# Altium schematic sheet IMx6Q_EX.SchDoc
size A3
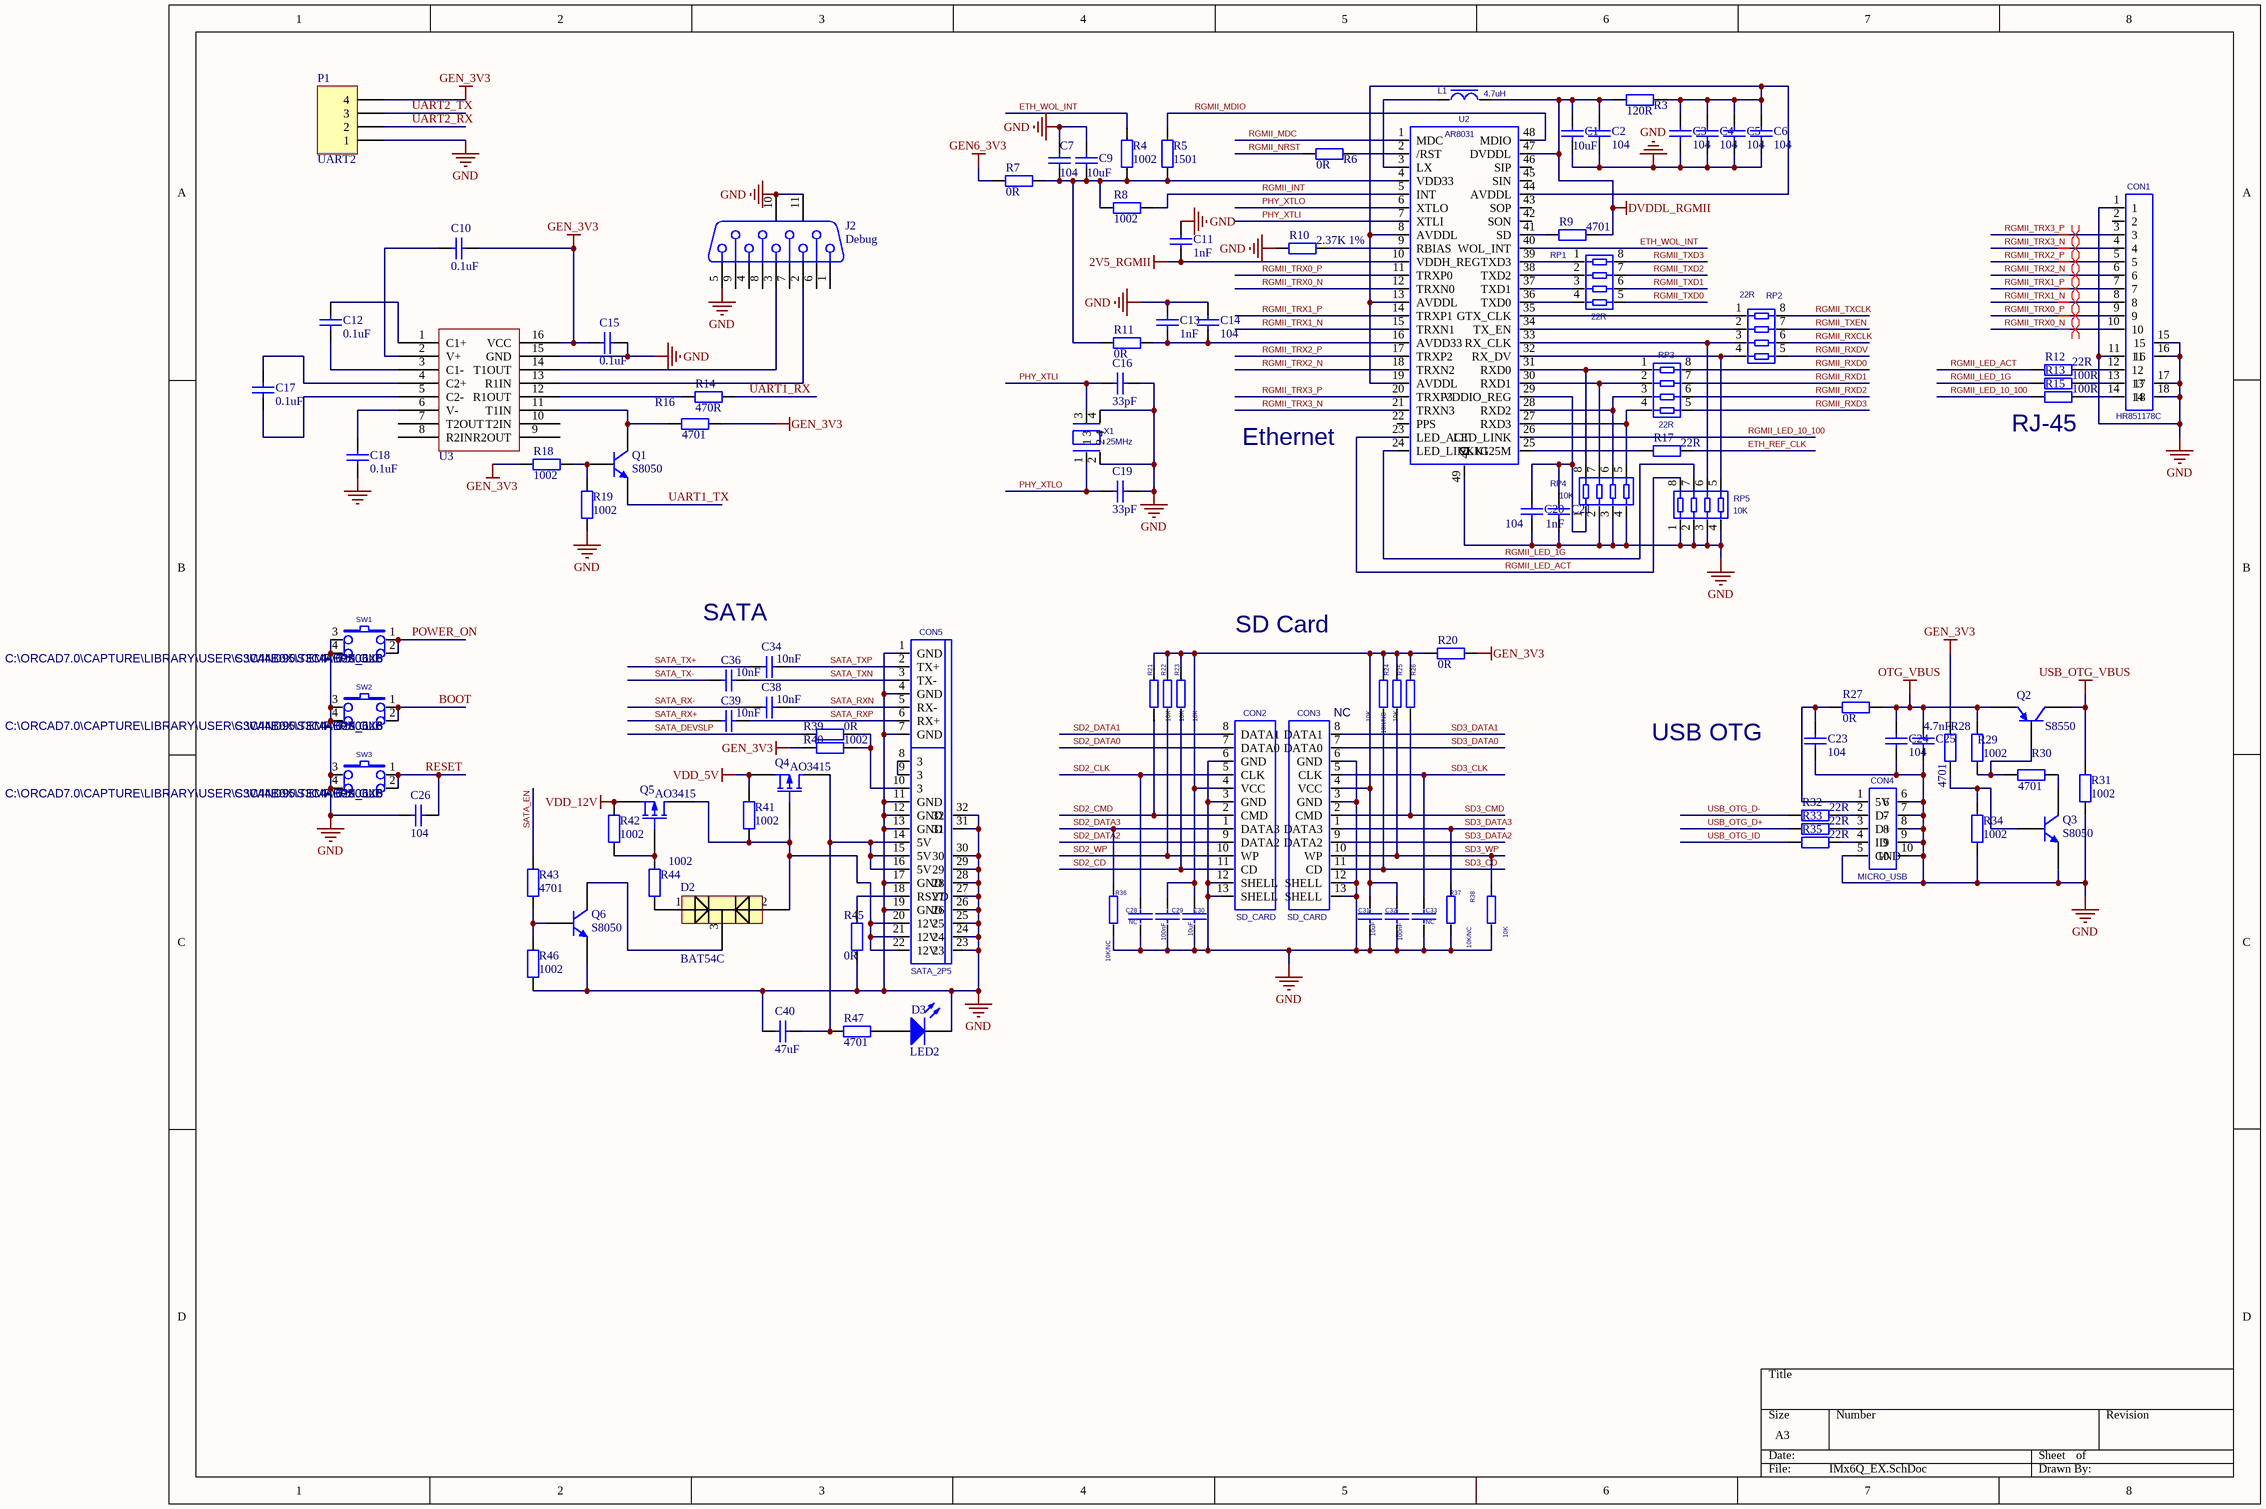
[diagram p0: IMx6Q_EX.SchDoc]

## Parts
C1  10uF  [0805C]
C2  104  [0805C]
C3  104  [0805C]
C4  104  [0805C]
C5  104  [0805C]
C6  104  [0805C]
C7  104  [0805C]
C9  10uF  [0805C]
C10  0.1uF  [0805C]
C11  1nF  [0805C]
C12  0.1uF  [0805C]
C13  1nF  [0805C]
C14  104  [0805C]
C15  0.1uF  [0805C]
C16  33pF  [0805C]
C17  0.1uF  [0805C]
C18  0.1uF  [0805C]
C19  33pF  [0805C]
C20  104  [0805C]
C21  1nF  [0805C]
C23  104  [0805C]
C24  104  [0805C]
C25  4.7nF  [0805C]
C26  104  [0805C]
C28  value NC  [0805C]  (hidden comment: C_0603)
C29  value 100nF  [0805C]  (hidden comment: C_0603)
C30  value 10uF  [0805C]  (hidden comment: C_0603)
C31  value 10uF  [0805C]  (hidden comment: C_0603)
C32  value 100nF  [0805C]  (hidden comment: C_0603)
C33  value NC  [0805C]  (hidden comment: C_0603)
C34  10nF  [0805C]
C36  10nF  [0805C]
C38  10nF  [0805C]
C39  10nF  [0805C]
C40  47uF  [0805C]
CON1  HR851178C  [HR851178C]
CON2  SD_CARD  [SD_CARD]
CON3  SD_CARD  [SD_CARD]
CON4  MICRO_USB  [MICRO_USB]
CON5  SATA_2P5  [SATA_MICRO_2P5]
D2  BAT54C  [SOT-23-3]
D3  LED2  [0805_LED]
J2  Debug  [DSUB1.385-2H9]
L1  value 4.7uH  [L_3-3]  (hidden comment: L_3-3)
P1  UART2  [HDR1X4]
Q1  S8050  [SOT23]
Q2  S8550  [SOT23-S8550]
Q3  S8050  [SOT23]
Q4  AO3415  [SOT23-AO3415]
Q5  AO3415  [SOT23-AO3415]
Q6  S8050  [SOT23-AO3415]
R3  120R  [0805R]
R4  1002  [0805R]
R5  1501  [0805R]
R6  0R  [0805R]
R7  0R  [0805R]
R8  1002  [0805R]
R9  4701  [0805R]
R10  2.37K 1%  [0805R]
R11  0R  [0805R]
R12  22R  [0805R]
R13  100R  [0805R]
R14  470R  [0805R]
R15  100R  [0805R]
R16  4701  [0805R]
R17  22R  [0805R]
R18  1002  [0805R]
R19  1002  [0805R]
R20  0R  [0805R]
R21  value 10K  [0805R]  (hidden comment: R_0603)
R22  value 10K  [0805R]  (hidden comment: R_0603)
R23  value 10K  [0805R]  (hidden comment: R_0603)
R24  value 10K  [0805R]  (hidden comment: R_0603)
R25  value 10K/NC  [0805R]  (hidden comment: R_0603)
R26  value 10K  [0805R]  (hidden comment: R_0603)
R27  0R  [0805R]
R28  4701  [0805R]
R29  1002  [0805R]
R30  4701  [0805R]
R31  1002  [0805R]
R32  22R  [0805R]
R33  22R  [0805R]
R34  1002  [0805R]
R35  22R  [0805R]
R36  value 10K/NC  [0805R]  (hidden comment: R_0603)
R37  value 10K/NC  [0805R]  (hidden comment: R_0603)
R38  value 10K  [0805R]  (hidden comment: R_0603)
R39  0R  [0805R]
R40  1002  [0805R]
R41  1002  [0805R]
R42  1002  [0805R]
R43  4701  [0805R]
R44  1002  [0805R]
R45  0R  [0805R]
R46  1002  [0805R]
R47  4701  [0805R]
RP1  value 22R  [RP4_0603]  (hidden comment: RP4_0603)
RP2  value 22R  [RP4_0603]  (hidden comment: RP4_0603)
RP3  value 22R  [RP4_0603]  (hidden comment: RP4_0603)
RP4  value 10K  [RP4_0603]  (hidden comment: RP4_0603)
RP5  value 10K  [RP4_0603]  (hidden comment: RP4_0603)
SW1  ALPS_6X6  Source Path: C:\ORCAD7.0\CAPTURE\LIBRARY\USER\S3C44B0X\S3C44B0X.OLB  SDTSourceLibName: C:\WIND95\TEMP\6200.LIB  [ALPS_6*6]
SW2  ALPS_6X6  Source Path: C:\ORCAD7.0\CAPTURE\LIBRARY\USER\S3C44B0X\S3C44B0X.OLB  SDTSourceLibName: C:\WIND95\TEMP\6200.LIB  [ALPS_6*6]
SW3  ALPS_6X6  Source Path: C:\ORCAD7.0\CAPTURE\LIBRARY\USER\S3C44B0X\S3C44B0X.OLB  SDTSourceLibName: C:\WIND95\TEMP\6200.LIB  [ALPS_6*6]
U2  AR8031  [QFN-48]
U3  MAX232  [SOP16]  (value not drawn)
X1  value 25MHz  [OSC_3225_4P]  (hidden comment: OSC_3225_4P)

## Nets
2V5_RGMII: C11.2 U2.10(VDDH_REG)
DVDDL_RGMII: C1.1 C2.1 L1.2 R3.1 R9.1 U2.47(DVDDL)
GEN6_3V3: R7.1
GEN_3V3: C10.1 C15.2 P1.4 R16.1 R18.2 R20.2 R28.2 R40.2 U3.16(VCC)
GND: C1.2 C2.2 C3.2 C4.2 C5.2 C6.2 C7.2 C9.2 C11.1 C13.1 C14.1 C15.1 C16.2 C18.1 C19.2 C20.2 C21.2 C23.2 C24.2 C25.2 C26.1 C28.1 C29.1 C30.1 C31.1 C32.1 C33.1 C40.2 CON1.1 CON1.11 CON1.15 CON1.16 CON1.17 CON1.18 CON2.3(GND) CON2.6(GND) CON2.12(SHELL) CON2.13(SHELL) CON3.3(GND) CON3.6(GND) CON3.12(SHELL) CON3.13(SHELL) CON4.5(GND) CON4.6 CON4.7 CON4.8 CON4.9 CON4.10 CON5.1(GND) CON5.4(GND) CON5.7(GND) CON5.11(GND) CON5.12(GND) CON5.13(GND) CON5.17(GND) CON5.19(GND) CON5.23 CON5.24 CON5.25 CON5.26 CON5.27 CON5.28 CON5.29 CON5.30 CON5.31 CON5.32 D3.2(K) J2.5 J2.10(MH1) J2.11(MH2) P1.1 Q3.1(E) Q6.3(E) R10.1 R19.2 R31.1 R34.1 R36.1 R37.1 R38.1 R45.2 R46.2 RP4.2 RP4.3 RP4.4 RP5.1 RP5.2 RP5.3 RP5.4 SW1.3 SW1.4 SW2.3 SW2.4 SW3.3 SW3.4 U2.49 U3.15(GND) X1.2 X1.4
OTG_VBUS: C24.1 C25.1 Q2.3(E) R27.2 R29.2
USB_OTG_VBUS: Q2.1(C) R31.2
VDD_5V: Q4.3(S) R41.1
VDD_12V: Q5.3(S) R42.1
BOOT: SW2.1 SW2.2
ETH_REF_CLK: R17.1
ETH_WOL_INT: R4.2 U2.40(WOL_INT)
PHY_XTLI: C16.1 U2.7(XTLI) X1.3
PHY_XTLO: C19.1 U2.6(XTLO) X1.1
POWER_ON: SW1.1 SW1.2
RESET: C26.2 SW3.1 SW3.2
RGMII_INT: R8.1 U2.5(INT)
RGMII_LED_1G: R13.2 RP5.7 U2.24(LED_LINK1G)
RGMII_LED_10_100: R15.2 U2.26(LED_LINK)
RGMII_LED_ACT: R12.2 RP5.8 U2.23(LED_ACT)
RGMII_MDC: U2.1(MDC)
RGMII_MDIO: R5.2 U2.48(MDIO)
RGMII_NRST: R6.1
RGMII_RXCLK: RP2.6
RGMII_RXD0: RP3.8
RGMII_RXD1: RP3.7
RGMII_RXD2: RP3.6
RGMII_RXD3: RP3.5
RGMII_RXDV: RP2.5
RGMII_TRX0_N: CON1.10 U2.12(TRXN0)
RGMII_TRX0_P: CON1.9 U2.11(TRXP0)
RGMII_TRX1_N: CON1.8 U2.15(TRXN1)
RGMII_TRX1_P: CON1.7 U2.14(TRXP1)
RGMII_TRX2_N: CON1.6 U2.18(TRXN2)
RGMII_TRX2_P: CON1.5 U2.17(TRXP2)
RGMII_TRX3_N: CON1.4 U2.21(TRXN3)
RGMII_TRX3_P: CON1.3 U2.20(TRXP3)
RGMII_TXCLK: RP2.8
RGMII_TXD0: RP1.5
RGMII_TXD1: RP1.6
RGMII_TXD2: RP1.7
RGMII_TXD3: RP1.8
RGMII_TXEN: RP2.7
SATA_DEVSLP: R39.2
SATA_EN: R43.1
SATA_RX+: C39.1
SATA_RX-: C38.1
SATA_RXN: C38.2 CON5.5(RX-)
SATA_RXP: C39.2 CON5.6(RX+)
SATA_TX+: C34.1
SATA_TX-: C36.1
SATA_TXN: C36.2 CON5.3(TX-)
SATA_TXP: C34.2 CON5.2(TX+)
SD2_CD: CON2.11(CD) R23.1
SD2_CLK: C28.2 CON2.5(CLK)
SD2_CMD: CON2.2(CMD) R21.1
SD2_DATA0: CON2.7(DATA0)
SD2_DATA1: CON2.8(DATA1)
SD2_DATA2: CON2.9(DATA2)
SD2_DATA3: CON2.1(DATA3) R36.2
SD2_WP: CON2.10(WP) R22.1
SD3_CD: CON3.11(CD) R24.1
SD3_CLK: C33.2 CON3.5(CLK)
SD3_CMD: CON3.2(CMD) R26.1
SD3_DATA0: CON3.7(DATA0)
SD3_DATA1: CON3.8(DATA1)
SD3_DATA2: CON3.9(DATA2)
SD3_DATA3: CON3.1(DATA3) R37.2
SD3_WP: CON3.10(WP) R25.1 R38.2
UART1_RX: R14.2
UART1_TX: Q1.1(E)
UART2_RX: P1.2
UART2_TX: P1.3
USB_OTG_D+: R33.2
USB_OTG_D-: R32.2
USB_OTG_ID: R35.2
NetC3_1: C3.1 C4.1 C5.1 C6.1 R3.2 U2.8(AVDDL) U2.13(AVDDL) U2.19(AVDDL) U2.44(AVDDL)
NetC7_1: C7.1 C9.1 R4.1 R5.1 R7.2 R8.2 R11.1 U2.4(VDD33)
NetC10_2: C10.2 U3.2(V+)
NetC12_1: C12.1 U3.3(C1-)
NetC12_2: C12.2 U3.1(C1+)
NetC13_2: C13.2 C14.2 R11.2 U2.16(AVDD33)
NetC17_1: C17.1 U3.5(C2-)
NetC17_2: C17.2 U3.4(C2+)
NetC18_2: C18.2 U3.6(V-)
NetC20_1: C20.1 C21.1 RP4.1 U2.29(VDDIO_REG)
NetC23_1: C23.1 CON4.1(5V) R27.1
NetC29_2: C29.2 C30.2 C31.2 C32.2 CON2.4(VCC) CON3.4(VCC) R20.1 R21.2 R22.2 R23.2 R24.2 R25.2 R26.2
NetC40_1: C40.1 CON5.14(5V) CON5.15(5V) CON5.16(5V) Q4.1(D) R47.1
NetCON1_12: CON1.12 R12.1
NetCON1_13: CON1.13 R13.1
NetCON1_14: CON1.14 R15.1
NetCON4_2: CON4.2(D-) R32.1
NetCON4_3: CON4.3(D+) R33.1
NetCON4_4: CON4.4(ID) R35.1
NetCON5_8: CON5.8(3) CON5.9(3)
NetCON5_10: CON5.10(3) R39.1 R40.1
NetCON5_18: CON5.18(RSVD) R45.1
NetCON5_20: CON5.20(12V) CON5.21(12V) CON5.22(12V) D2.2(A) Q4.2(G) Q5.1(D) R41.2
NetD2_1: D2.1(A) R44.1
NetD2_3: D2.3(C) Q6.1(C)
NetD3_1: D3.1(A) R47.2
NetJ2_2: J2.2 U3.13(R1IN)
NetJ2_3: J2.3 U3.14(T1OUT)
NetL1_1: L1.1 U2.3(LX)
NetQ1_2: Q1.2(B) R18.1 R19.1
NetQ1_3: Q1.3(C) R16.2 U3.11(T1IN)
NetQ2_2: Q2.2(B) R29.1 R30.2
NetQ3_2: Q3.2(B) R28.1 R34.2
NetQ3_3: Q3.3(C) R30.1
NetQ5_2: Q5.2(G) R42.2 R44.2
NetQ6_2: Q6.2(B) R43.2 R46.1
NetR6_2: R6.2 U2.2(/RST)
NetR9_2: R9.2 U2.41(SD)
NetR10_2: R10.2 U2.9(RBIAS)
NetR14_1: R14.1 U3.12(R1OUT)
NetR17_2: R17.2 U2.25(CLK125M)
NetRP1_1: RP1.1 U2.39(TXD3)
NetRP1_2: RP1.2 U2.38(TXD2)
NetRP1_3: RP1.3 U2.37(TXD1)
NetRP1_4: RP1.4 U2.36(TXD0)
NetRP2_1: RP2.1 U2.35(GTX_CLK)
NetRP2_2: RP2.2 U2.34(TX_EN)
NetRP2_3: RP2.3 RP5.6 U2.33(RX_CLK)
NetRP2_4: RP2.4 RP5.5 U2.32(RX_DV)
NetRP3_1: RP3.1 RP4.8 U2.31(RXD0)
NetRP3_2: RP3.2 RP4.7 U2.30(RXD1)
NetRP3_3: RP3.3 RP4.6 U2.28(RXD2)
NetRP3_4: RP3.4 RP4.5 U2.27(RXD3)

Not connected (* = marked no-connect by the designer): CON1 2; J2 1 4 6 7 8 9; U2 22(PPS) 42(SON) 43(SOP) 45(SIN) 46(SIP); U3 7(T2OUT) 8(R2IN) 9(R2OUT) 10(T2IN)

## Layout directives
differential pair: RGMII_TRX0_N, RGMII_TRX0_P, RGMII_TRX1_N, RGMII_TRX1_P, RGMII_TRX2_N, RGMII_TRX2_P, RGMII_TRX3_N, RGMII_TRX3_P

## Notes on the sheet
- Ethernet
- (near R15) RJ-45
- SATA
- SD Card
- (near CON3) NC
- USB OTG

## Library data of the parts
C1-C7 C9 C11 C13 C14 C16 C19-C21 C23-C26 C34 C36 C38-C40 = Cap: Capacitor; Value: 100pF; Published: 8-Jun-2000; LatestRevisionDate: 17-Jul-2002; LatestRevisionNote: Re-released for DXP Platform.; PackageReference: RAD-0.3; Publisher: Altium Limited
C10 C12 C15 C17 C18 = 电容
D3 = LED2: Typical RED, GREEN, YELLOW, AMBER GaAs LED; Published: 8-Jun-2000; LatestRevisionDate: 17-Jul-2002; LatestRevisionNote: Re-released for DXP Platform.; PackageVersion: Feb-2002; PackageReference: 3.2X1.6X1.1; Publisher: Altium Limited
J2 = D Connector 9: Receptacle Assembly, 9 Position, Right Angle; PackageDocument: O; Positions: 9; Published: 15-Jun-2001; LatestRevisionDate: 17-Jul-2002; LatestRevisionNote: Re-released for DXP Platform.; DatasheetDocument: 1-Sep-1999; PackageReference: 788750; Publisher: Altium Limited; Orientation: Right Angle; Gender: Receptacle
P1 = Header 4: Header, 4-Pin; LatestRevisionDate: 17-Jul-2002; LatestRevisionNote: Re-released for DXP Platform.; Publisher: Altium Limited
Q1 Q3 = 2N3904: NPN General Purpose Amplifier; Published: 8-Jun-2000; LatestRevisionDate: 15-Jan-2003; LatestRevisionNote: PCB Footprint 'BCY-W3/D4.7' replaced; DatasheetVersion: 1997; PackageVersion: Sep-1998; PackageReference: TO-92A; Publisher: Altium Limited; Code_JEDEC: TO-92A; ComponentLink1Description: Manufacturer Link; ComponentLink1URL: http://www.fairchildsemi.com/; ComponentLink2Description: Datasheet; ComponentLink2URL: http://www.fairchildsemi.com/ds/2N%2F2N3904.pdf
Q2 = PNP: PNP Bipolar Transistor; Published: 8-Jun-2000; LatestRevisionDate: 29-May-2009; LatestRevisionNote: IPC-7351 Footprint Added.; PackageVersion: Aug-1999; PackageReference: SOT-23B; Publisher: Altium Limited; PackageDescription: 3-Pin SOT-23 Package 0.95 mm Pitch, 2.4 mm Lead Span
Q4 Q5 = MOSFET-P: P-Channel MOSFET; Published: 8-Jun-2000; LatestRevisionDate: 17-Jul-2002; LatestRevisionNote: Re-released for DXP Platform.; PackageVersion: 1995/1996; PackageReference: E3; Publisher: Altium Limited
Q6 = NPN: NPN Bipolar Transistor; Published: 8-Jun-2000; LatestRevisionDate: 17-Jul-2002; LatestRevisionNote: Re-released for DXP Platform.; PackageReference: TO-226; Publisher: Altium Limited; Code_JEDEC: TO-226-AA
R3-R8 R10 R11 R14 R20 R27-R31 R34 = 电阻
R9 R12 R13 R15-R19 R32 R33 R35 R39-R47 = Res2: Resistor; Value: 1K; Published: 8-Jun-2000; LatestRevisionDate: 17-Jul-2002; LatestRevisionNote: Re-released for DXP Platform.; PackageReference: AXIAL-0.4; Publisher: Altium Limited
SW1-SW3 = ALPS_6X6: PCB Footprint: TM118D-A; Value: SW_PUSH2; PCB DECAL: ALPS_6X6
CON1 = HR851178C: PCB DECAL: HR851178C
CON2 CON3 = SD_CARD: PCB DECAL: SD_CARD
CON4 = MICRO_USB: PCB DECAL: MICRO_USB
CON5 = SATA_2P5: PCB DECAL: SATA_2P5
L1 = L_3-3: PCB DECAL: L_3-3
RP1-RP5 = RP4_0603: PCB DECAL: RP4_0603
U2 = AR8031: PCB DECAL: QFN-48
X1 = OSC_3225_4P: PCB DECAL: OSC_3225_4P